# Altium schematic sheet Spindle.SchDoc
size A4; Organization: Altium Limited; Address1: L3, 12a Rodborough Rd; Address2: Frenchs Forest; Address3: NSW; Address4: Australia 2086; SheetNumber: 3; SheetTotal: 7
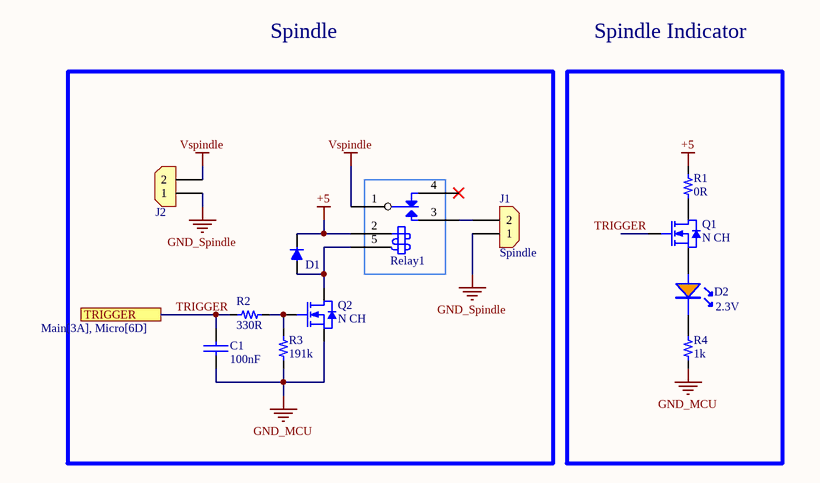
[diagram p0: Spindle.SchDoc]

## Parts
C1  value 100nF  [0603_cap]  (hidden comment: CAP CER 100nF 50V X7R 0603)
D1  DIODE STANDARD 50V 1A SOD-123F  [SOD-123FL_MCC]  (value not drawn)
D2  2.3V  [0805_LED]
J1  Connector 2pos  [CON_2x1_TH_5MM]  (value not drawn)
J2  Connector 2pos  [CON_2x1_TH_5MM]  (value not drawn)
Q1  N CH  [SOT_23_3]
Q2  N CH  [SOT_23_3]
R1  value 0R  [0603_res]  (hidden comment: 0R 1/10W)
R2  value 330R  [0603_res]  (hidden comment: 330R 1/10W)
R3  value 191k  [0603_res]  (hidden comment: 191k 1/10W)
R4  value 1k  [0603_res]  (hidden comment: 1k 1/10W)
Relay1  V_15A  [Relay_5V_15A]  (value not drawn)

## Blocks framed on the sheet
Spindle: C1 D1 J1 J2 Q2 R2 R3 Relay1

## Ports
TRIGGER (see Main[3A], Micro[6D])

## Nets
+5: D1.2(CATHODE) R1.2 Relay1.2
GND_MCU: C1.2 Q2.2(S) R3.2 R4.1
GND_Spindle: J1.1 J2.1
Vspindle: J2.2 Relay1.1
TRIGGER: C1.1 Q1.1(G) R2.1 ; port TRIGGER
NetD1_1: D1.1(ANODE) Q2.3(D) Relay1.5
NetD2_1: D2.1(A) Q1.2(S)
NetD2_2: D2.2 R4.2
NetJ1_2: J1.2 Relay1.3
NetQ1_3: Q1.3(D) R1.1
NetQ2_1: Q2.1(G) R2.2 R3.1

Not connected (* = marked no-connect by the designer): Relay1 4*

## Notes on the sheet
- Spindle
- Spindle Indicator
- Title
- Size:
- Date:
- A4
- Number:
- Time:
- Revision:
- Sheet
- of
- File:

## Library data of the parts
C1 = Cap_100nF_0603_50V: 50V 100nF X7R ±10% 0603 Ceramic Capacitors RoHS; Manufacturer: FOJAN; Manufacturer Part Number: FCC0603B104K500CT; Supplier 1: LCSC; Supplier Part Number 1: C5137636; ComponentLink1Description: LCSC; ComponentLink1URL: https://www.lcsc.com/product-detail/C5137636.html
D1 = Diode 1N4001W: 25A Independent 50V 1.1V@1A 1A SOD-123F Single Diodes RoHS; Manufacturer: YONGYUTAI; Manufacturer Part Number: 1N4001W; Supplier 1: LCSC; Supplier Part Number 1: C2944152; ComponentLink1Description: LCSC; ComponentLink1URL: https://www.lcsc.com/product-detail/C2944152.html
D2 = LED_0805_Orange: LED ORANGE WATER CLEAR 0805 SMD; Manufacturer: XINGLIGHT; Manufacturer Part Number: XL-2012UOC; Supplier 1: LCSC; Supplier Part Number 1: C965813; ComponentLink1Description: LCSC; ComponentLink1URL: https://www.lcsc.com/product-detail/C965813.html?s_z=n_XINGLIGHT%2520XL-2012
J1 J2 = Con_2x1_TH_5mm: 2POS 5MM; Manufacturer: JILN; Manufacturer Part Number: JL126-50002G01; Supplier 1: LCSC; Supplier Part Number 1: C394556; ComponentLink1Description: Digi-Key; ComponentLink1URL: https://www.lcsc.com/product-detail/Screw-terminal_JILN-JL126-50002G01_C394556.html
Q1 = Q_NFET_50V_200mA_SOT23: MOSFET N-CH 50V 200mA SOT-23; Manufacturer: onsemi; Manufacturer Part Number: BSS138LT1G; Supplier 1: LCSC; Supplier Part Number 1: C82045; ComponentLink1Description: LCSC; ComponentLink1URL: https://www.lcsc.com/product-detail/C82045.html
Q2 = Q_NFET_20V_3.2A_SOT23: MOSFET N-CH 20V SOT23; Manufacturer: Doeshare; Manufacturer Part Number: DN2302S; Supplier 1: LCSC; Supplier Part Number 1: C2931750; ComponentLink1Description: LCSC; ComponentLink1URL: https://www.lcsc.com/product-detail/MOSFETs_Doeshare-DN2302S_C2931750.html
R1 = Res_0R_0603_1/10W: RES SMD 0R OHM 5% 1/10W 0603; Manufacturer: FOJAN; Manufacturer Part Number: FRC0603P000 TS; ComponentLink1URL: https://www.lcsc.com/product-detail/Chip-Resistor-Surface-Mount_FOJAN-FRC0603P000-TS_C2907080.html; Supplier 1: LCSC; Supplier Part Number 1: C2907080; ComponentLink1Description: LCSC
R2 = Res_330R_0603_1/10W: RES SMD 330R OHM 5% 1/10W 0603; Manufacturer: FOJAN; Manufacturer Part Number: FRC0603J331 TS; ComponentLink1URL: https://www.lcsc.com/product-detail/Chip-Resistor-Surface-Mount_FOJAN-FRC0603J331-TS_C2907152.html; Supplier 1: LCSC; Supplier Part Number 1: C2907152; ComponentLink1Description: LCSC
R3 = Res_191k_0603_1/10W: 100mW Thick Film Resistor 75V ±100ppm/℃ ±1% 191kΩ 0603 Chip Resistor - Surface Mount ROHS; Manufacturer: YAGEO; Manufacturer Part Number: AC0603FR-07191KL; ComponentLink1URL: https://lcsc.com/product-detail/Chip-Resistor-Surface-Mount_YAGEO-AC0603FR-07191KL_C227635.html; Supplier 1: LCSC; Supplier Part Number 1: C227635; ComponentLink1Description: LCSC
R4 = Res_1k_0603_1/10W: RES SMD 1k OHM 5% 1/10W 0603; Manufacturer: FOJAN; Manufacturer Part Number: FRC0603J102 TS; ComponentLink1URL: https://www.lcsc.com/product-detail/Chip-Resistor-Surface-Mount_FOJAN-FRC0603J102-TS_C2907113.html; Supplier 1: LCSC; Supplier Part Number 1: C2907113; ComponentLink1Description: LCSC
Relay1 = Relay_5V_15A: 250V@AC 5V 15A 1 Form C: 1C (SPDT-CO) Plugin,15.6x19.2mm Power Relays ROHS; Manufacturer: Ningbo Songle Relay; Manufacturer Part Number: SRD-05VDC-SL-C; Supplier 1: LCSC; Supplier Part Number 1: C35449; ComponentLink1Description: LCSC; ComponentLink1URL: https://lcsc.com/product-detail/Power-Relays_Ningbo-Songle-Relay-SRD-05VDC-SL-C_C35449.html